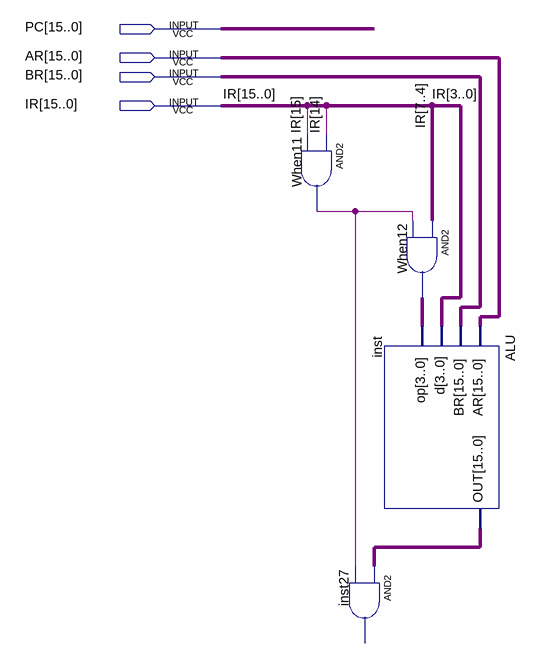
[diagram p0: schematic sheet]
// Quartus schematic phaze3.bdf as structural Verilog: 4 symbols, 4 pins
module phaze3 (
  input  [15:0] PC,
  input  [15:0] AR,
  input  [15:0] BR,
  input  [15:0] IR
);

  wire When11_out;
  wire [3:0] When12_out;
  wire [15:0] inst_out;

  and When11 (When11_out, IR[14], IR[15]);
  assign When12_out = IR[7:4] & {4{When11_out}};  // AND2 When12, 4 bits wide
  ALU inst (.AR(AR), .BR(BR), .d(IR[3:0]), .op(When12_out), .OUT(inst_out));
  // AND2 inst27 has open pins: IN1=inst_out, IN2=When11_out, OUT=open
endmodule
